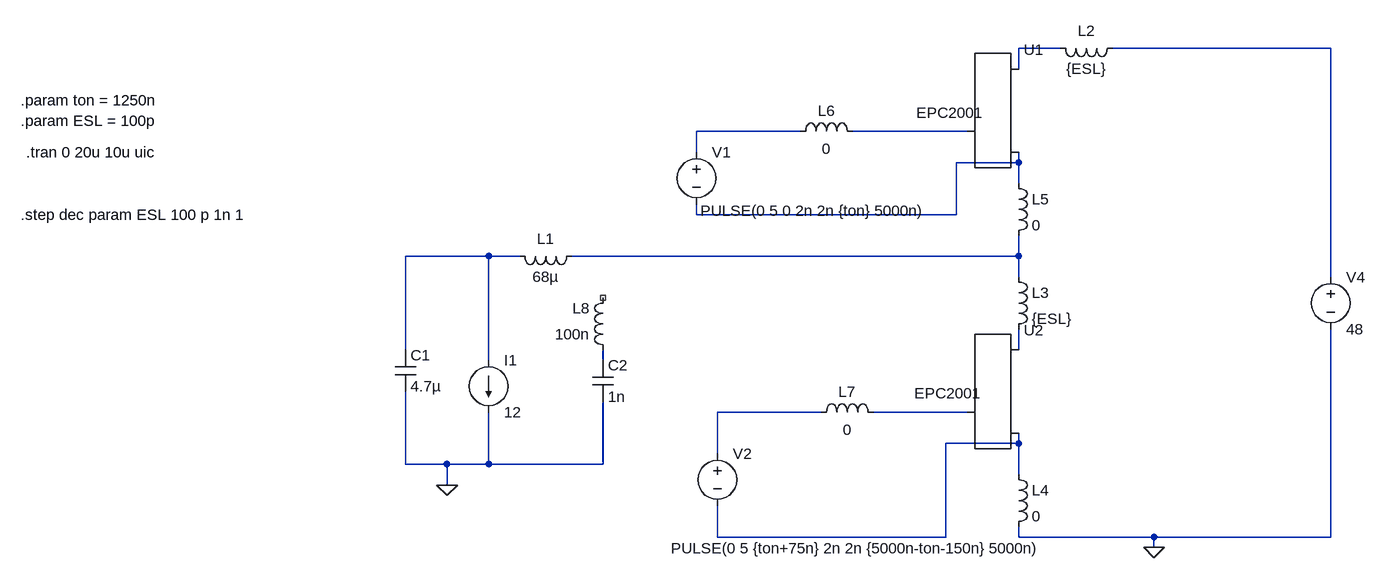
[diagram p0: schematic buck_CSI_2.asc]
buck_CSI_2.asc, the LTspice schematic file:
Version 4
SHEET 1 2008 680
WIRE 1280 -688 1216 -688
WIRE 1696 -688 1360 -688
WIRE 1216 -656 1216 -688
WIRE 880 -560 720 -560
WIRE 1136 -560 960 -560
WIRE 720 -528 720 -560
WIRE 1216 -512 1216 -528
WIRE 1216 -512 1120 -512
WIRE 1216 -480 1216 -512
WIRE 720 -432 720 -448
WIRE 1120 -432 1120 -512
WIRE 1120 -432 720 -432
WIRE 400 -368 272 -368
WIRE 448 -368 400 -368
WIRE 1216 -368 1216 -400
WIRE 1216 -368 528 -368
WIRE 1216 -336 1216 -368
WIRE 1696 -336 1696 -688
WIRE 272 -224 272 -368
WIRE 1216 -224 1216 -256
WIRE 400 -208 400 -368
WIRE 576 -208 576 -224
WIRE 912 -128 752 -128
WIRE 1136 -128 992 -128
WIRE 1216 -80 1216 -96
WIRE 1216 -80 1104 -80
WIRE 752 -64 752 -128
WIRE 272 -48 272 -160
WIRE 336 -48 272 -48
WIRE 400 -48 400 -128
WIRE 400 -48 336 -48
WIRE 576 -48 576 -144
WIRE 576 -48 400 -48
WIRE 1216 -32 1216 -80
WIRE 336 -16 336 -48
WIRE 752 64 752 16
WIRE 1104 64 1104 -80
WIRE 1104 64 752 64
WIRE 1216 64 1216 48
WIRE 1424 64 1216 64
WIRE 1696 64 1696 -256
WIRE 1696 64 1424 64
WIRE 1424 80 1424 64
FLAG 1424 80 0
FLAG 336 -16 0
SYMBOL voltage 720 -544 R0
WINDOW 3 6 106 Left 2
WINDOW 123 0 0 Left 2
SYMATTR Value PULSE(0 5 0 2n 2n {ton} 5000n)
SYMATTR SpiceLine Rser=2
SYMATTR InstName V1
SYMBOL voltage 1696 -352 R0
WINDOW 123 0 0 Left 2
SYMATTR SpiceLine Rser=2m
SYMATTR InstName V4
SYMATTR Value 48
SYMBOL ind 544 -384 R90
WINDOW 0 5 56 VBottom 2
WINDOW 3 32 56 VTop 2
SYMATTR InstName L1
SYMATTR Value 68µ
SYMATTR SpiceLine ic=12
SYMBOL EPCGaN 1136 -128 R0
WINDOW 3 -81 -29 Left 2
SYMATTR Value EPC2001
SYMATTR InstName U2
SYMBOL EPCGaN 1136 -560 R0
WINDOW 3 -78 -29 Left 2
SYMATTR Value EPC2001
SYMATTR InstName U1
SYMBOL voltage 752 -80 R0
WINDOW 3 -71 161 Left 2
WINDOW 123 0 0 Left 2
SYMATTR Value PULSE(0 5 {ton+75n} 2n 2n {5000n-ton-150n} 5000n)
SYMATTR SpiceLine Rser=2
SYMATTR InstName V2
SYMBOL ind 1376 -704 R90
WINDOW 0 5 56 VBottom 2
WINDOW 3 32 56 VTop 2
SYMATTR InstName L2
SYMATTR Value {ESL}
SYMATTR SpiceLine Rpar=10
SYMBOL ind 1200 -352 R0
SYMATTR InstName L3
SYMATTR Value {ESL}
SYMATTR SpiceLine Rpar=10
SYMBOL ind 864 -544 R270
WINDOW 0 32 56 VTop 2
WINDOW 3 5 56 VBottom 2
SYMATTR InstName L6
SYMATTR Value 0
SYMATTR SpiceLine Rser=1 Rpar=10
SYMBOL ind 896 -112 R270
WINDOW 0 32 56 VTop 2
WINDOW 3 5 56 VBottom 2
SYMATTR InstName L7
SYMATTR Value 0
SYMATTR SpiceLine Rser=1 Rpar=10
SYMBOL ind 1200 -48 R0
SYMATTR InstName L4
SYMATTR Value 0
SYMATTR SpiceLine Rpar=10
SYMBOL ind 1200 -496 R0
SYMATTR InstName L5
SYMATTR Value 0
SYMATTR SpiceLine Rpar=10
SYMBOL cap 256 -224 R0
SYMATTR InstName C1
SYMATTR Value 4.7µ
SYMATTR SpiceLine ic=12
SYMBOL current 400 -208 R0
WINDOW 123 0 0 Left 2
WINDOW 39 0 0 Left 2
SYMATTR InstName I1
SYMATTR Value 12
SYMBOL ind 592 -208 R180
WINDOW 0 36 80 Left 2
WINDOW 3 36 40 Left 2
SYMATTR InstName L8
SYMATTR Value 100n
SYMBOL cap 560 -208 R0
SYMATTR InstName C2
SYMATTR Value 1n
TEXT -312 -528 Left 2 !.tran 0 20u 10u uic
TEXT -320 -608 Left 2 !.param ton = 1250n\n.param ESL = 100p
TEXT -320 -432 Left 2 !.step dec param ESL 100 p 1n 1

The netlist it stands for:
* buck_CSI_2.asc
V1 N003 N005 PULSE(0 5 0 2n 2n {ton} 5000n) Rser=2
V4 N002 0 48 Rser=2m
L1 N007 N006 68µ ic=12
XU2 N011 N008 N012 EPC2001
XU1 N004 N001 N005 EPC2001
V2 N010 N012 PULSE(0 5 {ton+75n} 2n 2n {5000n-ton-150n} 5000n) Rser=2
L2 N002 N001 {ESL} Rpar=10
L3 N007 N008 {ESL} Rpar=10
L6 N003 N004 0 Rser=1 Rpar=10
L7 N010 N011 0 Rser=1 Rpar=10
L4 N012 0 0 Rpar=10
L5 N005 N007 0 Rpar=10
C1 N006 0 4.7µ ic=12
I1 N006 0 12
L8 N009 NC_01 100n
C2 N009 0 1n
.tran 0 20u 10u uic
.param ton = 1250n
.param ESL = 100p
.step dec param ESL 100 p 1n 1
.backanno
.end